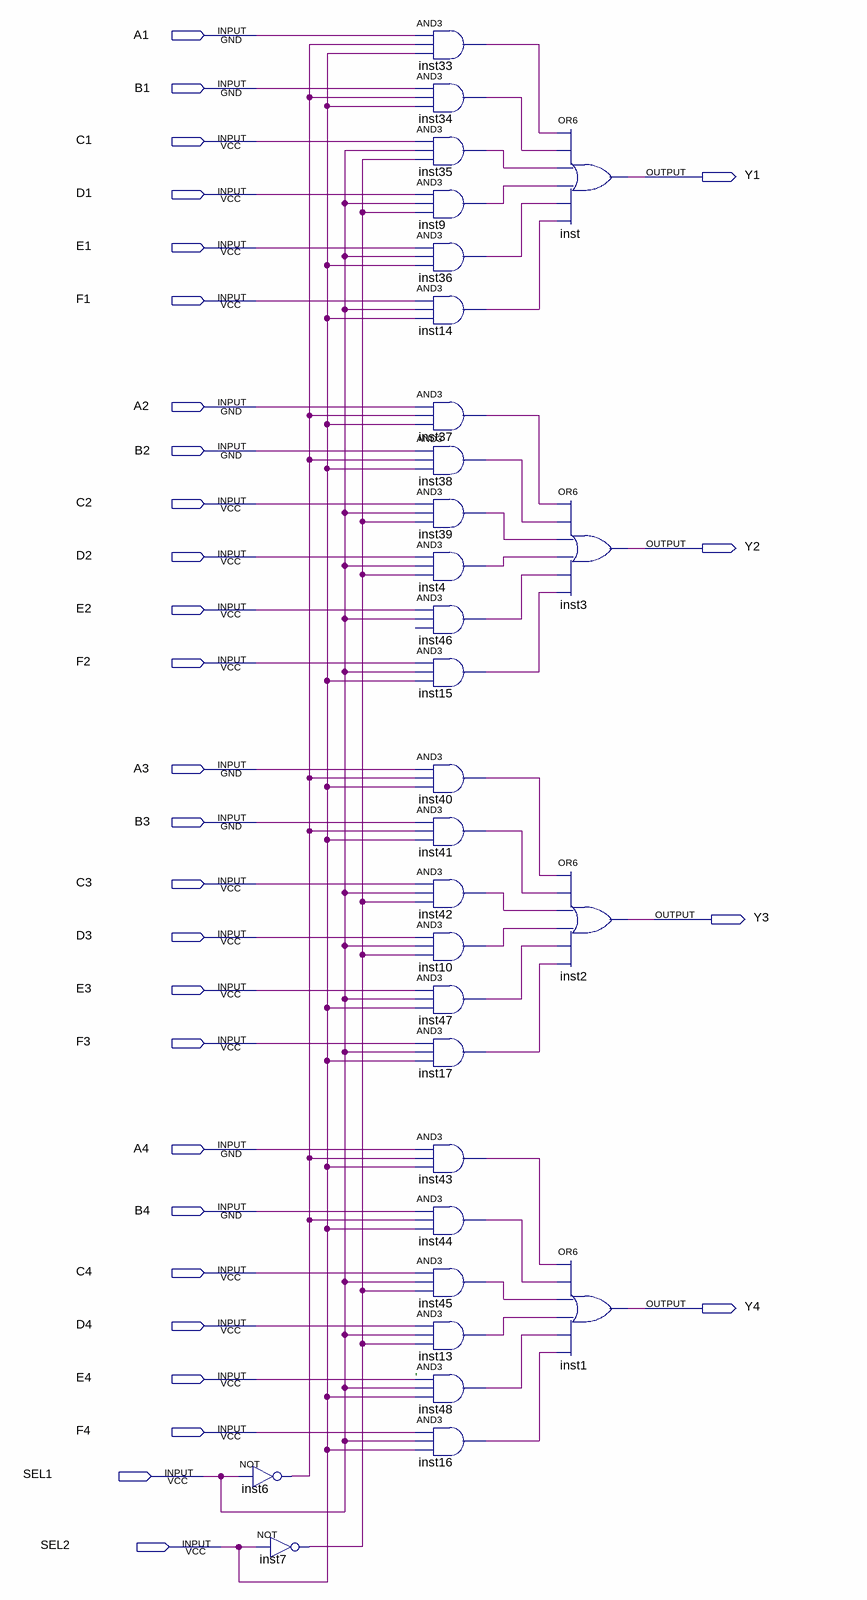
[diagram p0: schematic sheet]
// Quartus schematic MUXs.bdf as structural Verilog: 30 symbols, 30 pins
module MUXs (
  input  A1,
  input  B1,
  input  C1,
  input  D1,
  input  E1,
  input  F1,
  input  A2,
  input  B2,
  input  C2,
  input  D2,
  input  E2,
  input  F2,
  input  A3,
  input  B3,
  input  C3,
  input  D3,
  input  E3,
  input  F3,
  input  A4,
  input  B4,
  input  C4,
  input  D4,
  input  E4,
  input  F4,
  input  SEL1,
  input  SEL2,
  output Y1,
  output Y2,
  output Y3,
  output Y4
);

  wire inst4_out, inst6_out, inst7_out, inst9_out, inst10_out, inst13_out, inst14_out, inst15_out,
       inst16_out, inst17_out, inst33_out, inst34_out, inst35_out, inst36_out, inst37_out, inst38_out,
       inst39_out, inst40_out, inst41_out, inst42_out, inst43_out, inst44_out, inst45_out, inst46_out,
       inst47_out, inst48_out;

  not inst6 (inst6_out, SEL1);
  not inst7 (inst7_out, SEL2);
  and inst33 (inst33_out, A1, inst6_out, SEL2);
  and inst34 (inst34_out, B1, inst6_out, SEL2);
  and inst35 (inst35_out, C1, SEL1, inst7_out);
  and inst9 (inst9_out, D1, SEL1, inst7_out);
  and inst36 (inst36_out, E1, SEL1, SEL2);
  and inst14 (inst14_out, F1, SEL1, SEL2);
  and inst37 (inst37_out, A2, inst6_out, SEL2);
  and inst38 (inst38_out, B2, inst6_out, SEL2);
  and inst39 (inst39_out, C2, SEL1, inst7_out);
  and inst4 (inst4_out, D2, SEL1, inst7_out);
  and inst46 (inst46_out, E2, SEL1);  // open: IN3
  and inst15 (inst15_out, F2, SEL1, SEL2);
  and inst40 (inst40_out, A3, inst6_out, SEL2);
  and inst41 (inst41_out, B3, inst6_out, SEL2);
  and inst42 (inst42_out, C3, SEL1, inst7_out);
  and inst10 (inst10_out, D3, SEL1, inst7_out);
  and inst47 (inst47_out, E3, SEL1, SEL2);
  and inst17 (inst17_out, F3, SEL1, SEL2);
  and inst43 (inst43_out, A4, inst6_out, SEL2);
  and inst44 (inst44_out, B4, inst6_out, SEL2);
  and inst45 (inst45_out, C4, SEL1, inst7_out);
  and inst13 (inst13_out, D4, SEL1, inst7_out);
  and inst48 (inst48_out, E4, SEL1, SEL2);
  and inst16 (inst16_out, F4, SEL1, SEL2);
  or inst (Y1, inst33_out, inst34_out, inst35_out, inst9_out, inst36_out, inst14_out);
  or inst3 (Y2, inst37_out, inst38_out, inst39_out, inst4_out, inst46_out, inst15_out);
  or inst2 (Y3, inst40_out, inst41_out, inst42_out, inst10_out, inst47_out, inst17_out);
  or inst1 (Y4, inst43_out, inst44_out, inst45_out, inst13_out, inst48_out, inst16_out);

  // Notes on the sheet:
  //   '
endmodule
